# EasyEDA Pro project ProDoc_XC7K35T_GTP_USB_Core_LiteRevB.1.brd_2025-10-08.epro, board XC7K35T_GTP_USB_Core_LiteRevB.1.pcb
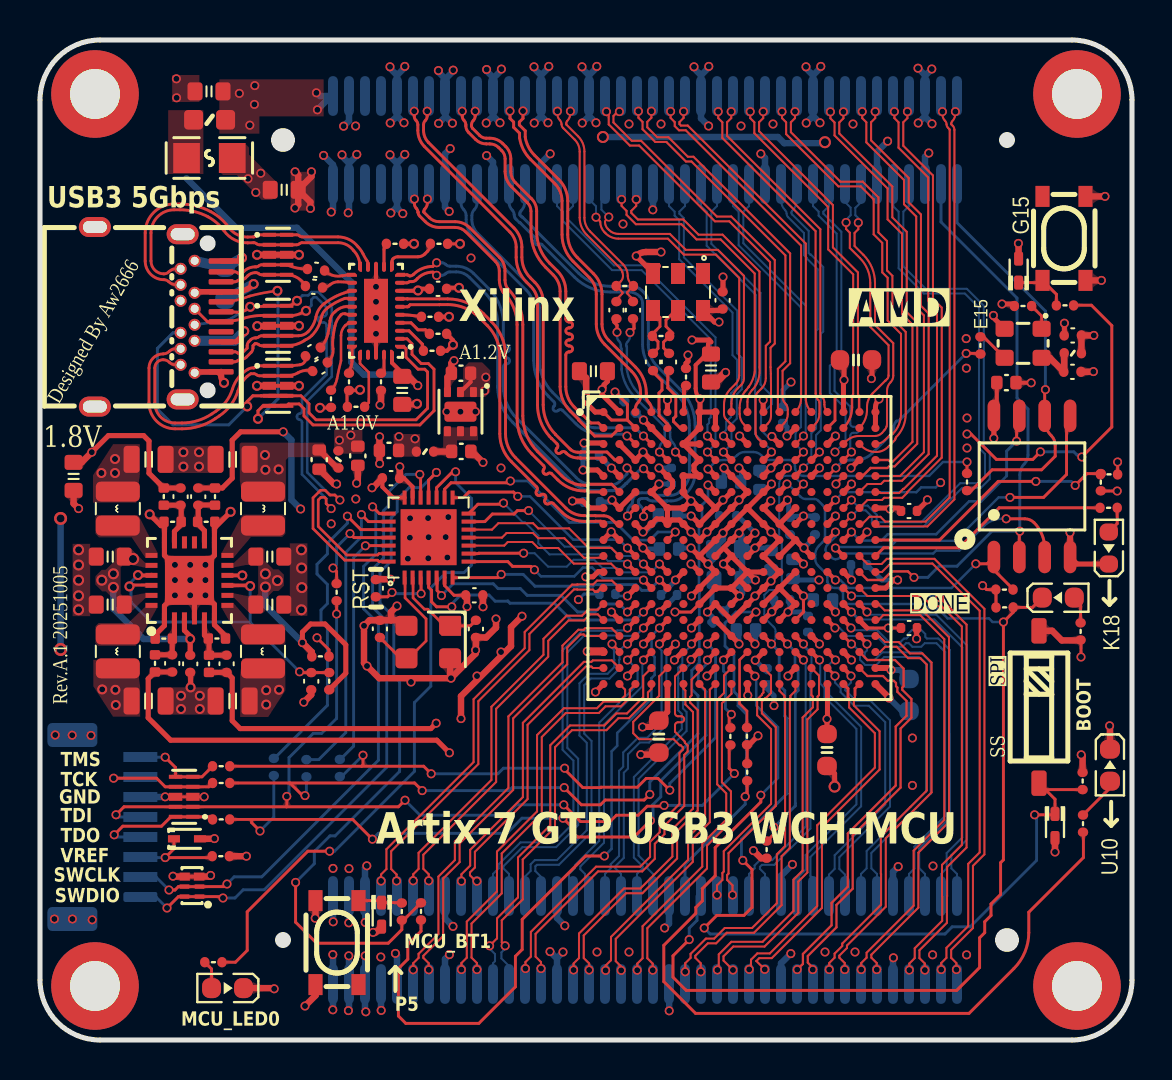
[diagram p15: board, top side]
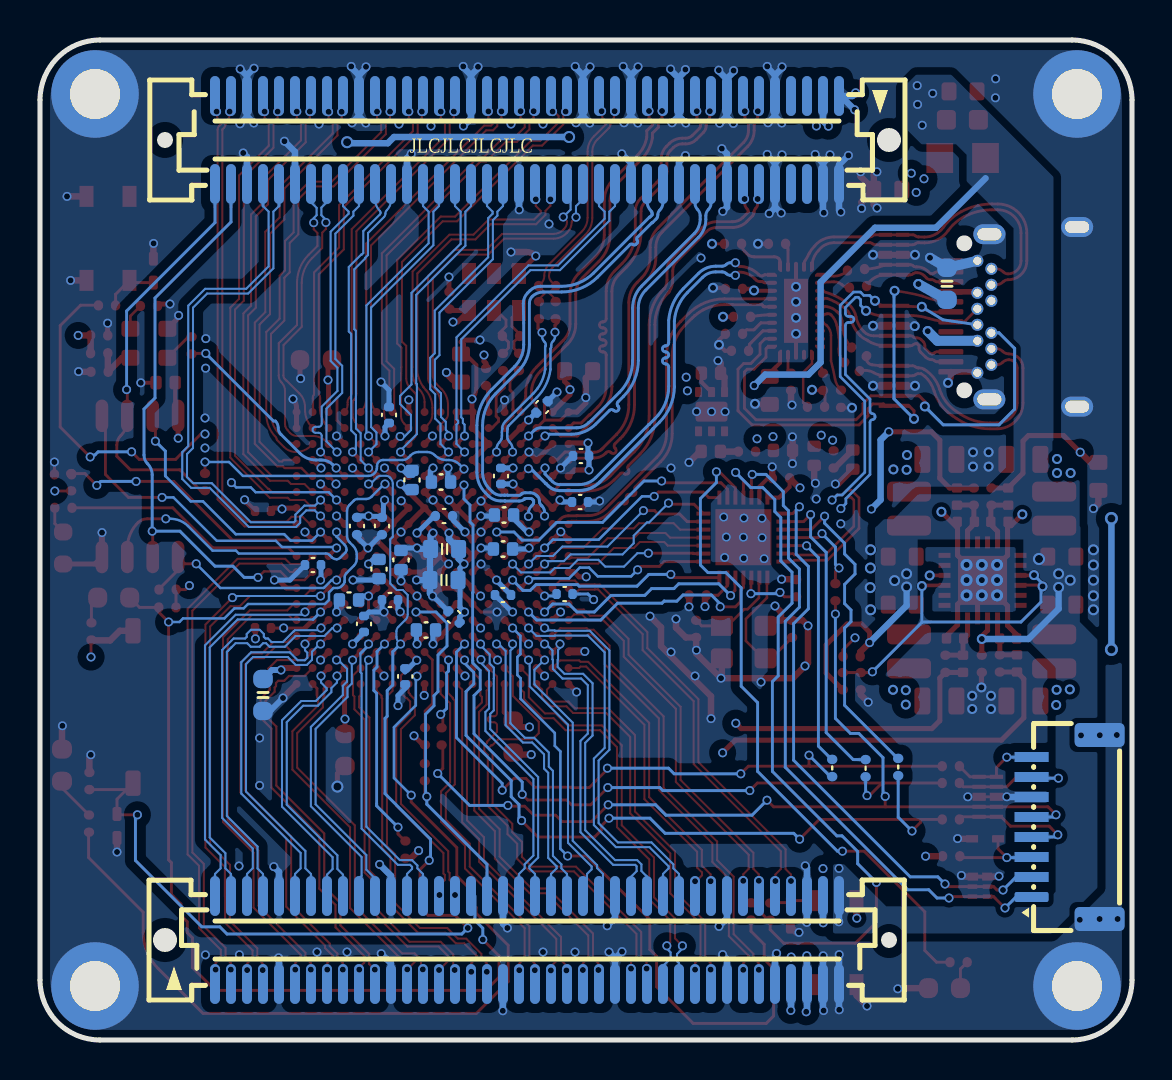
[diagram p16: board, bottom side, seen from below]

Outline 54.6 x 50 mm; copper layers: Top Layer, 内GND, 内GND&PWR, Bottom Layer. Coordinates in mm from the lower left corner of the outline.
Outline path: 0,47 0,3 arc(0.88,0.88) 3,0 51.6,0 arc(53.72,0.88) 54.6,3 54.6,47 arc(53.72,49.12) 51.6,50 3,50 arc(0.88,49.12) 0,47
Stack: Top Layer 0.035mm 外层铜厚1oz / Dielectric1 0.2104mm 7628 RC49% 8.6mil / 内GND 0.0152mm 内层铜厚 / Dielectric2 1.065mm 1.1mm H/HOZ Copper / 内GND&PWR 0.0152mm 内层铜厚 / Dielectric3 0.2104mm 7628 RC49% 8.6mil / Bottom Layer 0.035mm 外层铜厚1oz

## Design rules (mm)
net USBC_RX_P: DP6
net USBC_RX_N: DP6
net MGT_TX3_N: DP9
net MGT_TX2_N: DP7
net MGT_TX1_N: DP11
net MGT_TX0_N: DP16
net MGT_TX3_P: DP9
net MGT_TX2_P: DP7
net MGT_TX1_P: DP11
net MGT_TX0_P: DP16
net MGT_RX1_N: DP12
net MGT_RX2_N: DP8
net MGT_RX0_N: DP10
net MGT_RX3_N: DP20
net MGT_RX1_P: DP12
net MGT_RX2_P: DP8
net MGT_RX0_P: DP10
net MGT_RX3_P: DP20
net MGT_CLK1_N: DP13
net MGT_CLK0_N: DP14
net MGT_CLK1_P: DP13
net MGT_CLK0_P: DP14
net CLK_125M_P: DP23
net CLK_125M_N: DP23
net USB3_RX_N: DP17
net USB3_RX_P: DP17
net IO_L1N_T0_AD0N_15: DP25
net IO_L1P_T0_AD0P_15: DP25
net IO_L3N_T0_DQS_AD1N_15: DP26
net IO_L3P_T0_DQS_AD1P_15: DP26
net IO_L2N_T0_AD8N_15: DP24
net IO_L2P_T0_AD8P_15: DP24
net IO_L5N_T0_AD9N_15: DP27
net IO_L5P_T0_AD9P_15: DP27
net IO_L4N_T0_15: DP28
net IO_L4P_T0_15: DP28
net IO_L6P_T0_15: DP31
net IO_L7N_T1_AD2N_15: DP29
net IO_L7P_T1_AD2P_15: DP29
net IO_L6N_T0_VREF_15: DP31
net IO_L8P_T1_AD10P_15: DP30
net IO_L11N_T1_SRCC_15: DP32
net IO_L11P_T1_SRCC_15: DP32
net IO_L12P_T1_MRCC_15: DP39
net IO_L8N_T1_AD10N_15: DP30
net IO_L10P_T1_AD11P_15: DP33
net IO_L12N_T1_MRCC_15: DP39
net IO_L10N_T1_AD11N_15: DP33
net IO_L15P_T2_DQS_15: DP36
net IO_L16P_T2_A28_15: DP34
net IO_L14N_T2_SRCC_15: DP40
net IO_L14P_T2_SRCC_15: DP40
net IO_L20N_T3_A19_15: DP48
net IO_L20P_T3_A20_15: DP48
net IO_L15N_T2_DQS_ADV_B_15: DP36
net IO_L16N_T2_A27_15: DP34
net IO_L18P_T2_A24_15: DP37
net IO_L17P_T2_A26_15: DP38
net IO_L24P_T3_RS1_15: DP41
net IO_L19P_T3_A22_15: DP47
net IO_L23P_T3_FOE_B_15: DP35
net IO_L18N_T2_A23_15: DP37
net IO_L17N_T2_A25_15: DP38
net IO_L24N_T3_RS0_15: DP41
net IO_L19N_T3_A21_VREF_15: DP47
net IO_L23N_T3_FWE_B_15: DP35
net IO_L13N_T2_MRCC_34: DP46
net IO_L3N_T0_DQS_34: DP67
net IO_L7N_T1_34: DP69
net IO_L9P_T1_DQS_34: DP42
net IO_L9N_T1_DQS_34: DP42
net IO_L15N_T2_DQS_34: DP66
net IO_L3P_T0_DQS_34: DP67
net IO_L7P_T1_34: DP69
net IO_L13P_T2_MRCC_34: DP46
net IO_L14N_T2_SRCC_34: DP62
net IO_L15P_T2_DQS_34: DP66
net IO_L16N_T2_34: DP73
net IO_L12N_T1_MRCC_34: DP63
net IO_L14P_T2_SRCC_34: DP62
net IO_L17N_T2_34: DP49
net IO_L16P_T2_34: DP73
net IO_L12P_T1_MRCC_34: DP63
net IO_L17P_T2_34: DP49
net IO_L18P_T2_34: DP74
net IO_L18N_T2_34: DP74
net IO_L21P_T3_DQS_34: DP64
net IO_L21N_T3_DQS_34: DP64
net IO_L20N_T3_34: DP75
net IO_L20P_T3_34: DP75
net IO_L23N_T3_34: DP58
net IO_L22P_T3_34: DP65
net IO_L22N_T3_34: DP65
net IO_L23P_T3_34: DP58
net IO_L24N_T3_34: DP50
net IO_L24P_T3_34: DP50
net IO_L24P_T3_A01_D17_14: DP43
net IO_L24N_T3_A00_D16_14: DP43
net IO_L23P_T3_A03_D19_14: DP44
net IO_L23N_T3_A02_D18_14: DP44
net IO_L21P_T3_DQS_14: DP45
net IO_L19P_T3_A10_D26_14: DP61
net IO_L19N_T3_A09_D25_VREF_14: DP61
net IO_L21N_T3_DQS_A06_D22_14: DP45
net IO_L13P_T2_MRCC_14: DP60
net IO_L20P_T3_A08_D24_14: DP57
net IO_L20N_T3_A07_D23_14: DP57
net IO_L11P_T1_SRCC_14: DP72
net IO_L13N_T2_MRCC_14: DP60
net IO_L17P_T2_A14_D30_14: DP59
net IO_L7P_T1_D09_14: DP70
net IO_L9P_T1_DQS_14: DP55
net IO_L11N_T1_SRCC_14: DP72
net IO_L14P_T2_SRCC_14: DP54
net IO_L17N_T2_A13_D29_14: DP59
net IO_L18P_T2_A12_D28_14: DP56
net IO_L4P_T0_D04_14: DP68
net IO_L7N_T1_D10_14: DP70
net IO_L9N_T1_DQS_D13_14: DP55
net IO_L14N_T2_SRCC_14: DP54
net IO_L16P_T2_CSI_B_14: DP53
net IO_L16N_T2_A15_D31_14: DP53
net IO_L18N_T2_A11_D27_14: DP56
net IO_L4N_T0_D05_14: DP68
net IO_L10P_T1_D14_14: DP51
net IO_L10N_T1_D15_14: DP51
net IO_L15P_T2_DQS_RDWR_B_14: DP52
net IO_L15N_T2_DQS_DOUT_CSO_B_14: DP52
net CH32_USB2_D_N: DP76
net CH32_USB2_D_P: DP76
net MGT_EXTCLK0_P: DP71
net MGT_EXTCLK0_N: DP71
template: 通用免费4层工艺
spacing copperThickness1oz (default): track to track 0.1, other pairs 0.1 to 0.3
spacing copperThickness2oz: track to track 0.203, other pairs 0.152 to 0.3
track width copperThickness2oz: min 0.203, default 0.254, max 2.54
track width trackW_1oz_50R_3313 (default): min 0.1, default 0.145, max 10
track width trackW_1oz_40R_3313: min 0.127, default 0.2, max 2.54
track width trackWidth1oz_POWER: min 0.1, default 0.32, max 3
track width trackWidthAnalog: min 0.1, default 0.2, max 10
differential pair diff_100R_3313 (default): width min 0.1, default 0.102, max 2; gap min 0.132, default 0.135
differential pair diff_100R_7628: width min 0.1, default 0.14, max 2.54; gap min 0.102, default 0.12
differential pair diff_80R_3313: width min 0.1, default 0.15, max 2.54; gap min 0.1, default 0.102
differential pair diff_85R_3313: width min 0.127, default 0.15, max 2.54; gap min 0.102, default 0.13
differential pair diff_90R_3313: width min 0.102, default 0.13, max 2; gap min 0.102, default 0.13
differential pair diff_90R_7628: width min 0.1, default 0.195, max 2.54; gap min 0.102, default 0.12
differential pair diff_90R_85R_3313: width min 0.127, default 0.145, max 2.54; gap min 0.102, default 0.14
differential pair diff_90R_Mini_3313: width min 0.102, default 0.115, max 2.54; gap min 0.102, default 0.152
differential pair diff_100R_3313_max: width min 0.1, default 0.12, max 2.54; gap min 0.1, default 0.145
via viaSize (default): diameter min 0.4, default 0.45, max 10; hole min 0.3, default 0.3, max 6.3
via viaSizePOWER: diameter min 0.5, default 0.5, max 10; hole min 0.3, default 0.35, max 6.3
net GND uses trackWidth1oz_POWER
net MGT_TX3_N uses diff_90R_85R_3313
net MGT_TX2_N uses diff_90R_85R_3313
net MGT_TX1_N uses diff_90R_85R_3313
net MGT_TX0_N uses diff_90R_85R_3313
net MGT_TX3_P uses diff_90R_85R_3313
net MGT_TX2_P uses diff_90R_85R_3313
net MGT_TX1_P uses diff_90R_85R_3313
net MGT_TX0_P uses diff_90R_85R_3313
net MGT_RX1_N uses diff_90R_85R_3313
net MGT_RX2_N uses diff_90R_85R_3313
net MGT_RX0_N uses diff_90R_85R_3313
net MGT_RX3_N uses diff_90R_85R_3313
net MGT_RX1_P uses diff_90R_85R_3313
net MGTAVCC_1V0 uses trackWidth1oz_POWER
net MGT_RX2_P uses diff_90R_85R_3313
net MGT_RX0_P uses diff_90R_85R_3313
net MGT_RX3_P uses diff_90R_85R_3313
net MGT_CLK1_N uses diff_100R_3313_max
net MGT_CLK0_N uses diff_100R_3313_max
net MGT_CLK1_P uses diff_100R_3313_max
net MGT_CLK0_P uses diff_100R_3313_max
net VCC_1V0 uses trackWidth1oz_POWER
net VCC_1V8 uses trackWidth1oz_POWER
net VCC_5V uses trackWidth1oz_POWER
net VCC_2V5 uses trackWidth1oz_POWER
net VCC_1V8_F uses trackWidth1oz_POWER
net VCC_3V3_CLK uses trackWidth1oz_POWER
net VCC_2V5_CLK uses trackWidth1oz_POWER
net VCC_3V3 uses trackWidth1oz_POWER
net CH32_USB2_D_N uses diff_90R_3313
net CH32_USB2_D_P uses diff_90R_3313
diff pair DP9 uses diff_90R_85R_3313
diff pair DP7 uses diff_90R_85R_3313
diff pair DP11 uses diff_90R_85R_3313
diff pair DP16 uses diff_90R_85R_3313
diff pair DP12 uses diff_90R_85R_3313
diff pair DP8 uses diff_90R_85R_3313
diff pair DP10 uses diff_90R_85R_3313
diff pair DP20 uses diff_90R_85R_3313
diff pair DP13 uses diff_100R_3313_max
diff pair DP14 uses diff_100R_3313_max
diff pair DP76 uses diff_90R_3313
pour e396 uses copperRegion1
pour e11925 uses copperRegion2
pour e8768 uses copperRegion2

## Placement (name value [footprint] x y rotation side)
C1  4.7uF  [C0603_1608M]  9.25 37.81 270 bottom
C2  4.7uF  [C0603_1608M_S]  33.55 33.6 270 top
C3  4.7uF  [C0603_1608M_S]  27.67 33.44 0 top
C4  470nF  [C0402_1005M_BGA]  31.55 28.2 90 bottom
C5  470nF  [C0402_1005M_BGA]  29.5 31.65 315 bottom
C6  470nF  [C0402_1005M_BGA]  27.6 26.9 0 bottom
C7  470nF  [C0402_1005M_BGA]  27.55 29.2 180 bottom
C8  100nF  [C0402_1005M_S]  14 33.66 30 top
C9  100nF  [C0402_1005M_S]  13.65 34.41 30 top
C10  100nF  [C0402_1005M_S]  13.8 38.51 355 top
C11  100nF  [C0402_1005M_S]  13.7 37.66 355 top
C12  100nF  [C0402_1005M_S]  31.45 33.9 270 top
C13  100nF  [C0402_1005M_S]  30.65 33.9 270 top
C14  100nF  [C0402_1005M_S]  29.65 36.49 270 top
C15  100nF  [C0402_1005M_S]  28.82 36.49 270 top
C16  220pF  [C0402_1005M_S]  7.03 27.17 90 top
C17  22uF  [C0805_2012M_S]  5.43 29.03 180 top
C18  22uF  [C0603_1608M_S]  3.51 21.77 0 top
C19  22uF  [C0603_1608M_S]  11.49 24.17 180 top
C20  22uF  [C0603_1608M_S]  3.51 24.17 0 top
C21  22uF  [C0603_1608M_S]  11.49 21.77 180 top
C22  2.2uF  [C0402_1005M_S]  7.51 18.81 90 top
C23  2.2uF  [C0402_1005M_S]  34.4 26.2 0 bottom
C24  2.2uF  [C0402_1005M_S]  37.5 25.7 90 bottom
C25  2.2uF  [C0402_1005M]  34.55 27.9 0 bottom
C26  2.2uF  [C0402_1005M]  35.3 20.5 0 bottom
C27  220pF  [C0402_1005M_S]  6.61 18.83 270 top
C28  22uF  [C0805_2012M_S]  5.43 16.95 0 top
C29  220pF  [C0402_1005M_S]  9.33 18.81 270 top
C30  22uF  [C0805_2012M_S]  9.63 16.95 180 top
C31  220pF  [C0402_1005M_S]  7.91 27.17 90 top
C32  22uF  [C0805_2012M_S]  9.63 29.03 180 top
C158  10uF  [C0402_1005M_S]  51.64 35.23 0 top
C159  10uF  [C0402_1005M_S]  51.62 33.41 180 top
C160  2.2uF  [C0402_1005M]  48.32 32.87 180 top
C161  470nF  [C0402_1005M_BGA]  40.95 23.75 180 bottom
C162  470nF  [C0402_1005M_BGA]  43.45 20.6 180 top
C163  470nF  [C0402_1005M_BGA]  38.4 20.8 270 bottom
C164  470nF  [C0402_1005M_BGA]  36.34 18.18 90 bottom
C165  4.7uF  [C0603_1608M]  39.35 14.5 90 top
C166  4.7uF  [C0603_1608M]  43.45 17.25 90 bottom
C170  10nF  [C0402_1005M_S]  13.56 17.94 90 top
C171  2.2uF  [C0402_1005M]  17.45 29.48 0 top
C173  2.2uF  [C0402_1005M]  13.96 29.02 90 top
C174  2.2uF  [C0402_1005M]  21.06 29.43 180 top
C175  2.2uF  [C0402_1005M]  15.89 29.21 90 top
C176  2.2uF  [C0402_1005M]  21.05 33.34 0 top
C177  470nF  [C0402_1005M_BGA]  37.15 31.25 270 bottom
C178  470nF  [C0402_1005M_BGA]  43.45 26.45 180 top
C179  4.7uF  [C0603_1608M]  40.8 34 180 top
C180  470nF  [C0402_1005M_BGA]  28.37 22.3 0 bottom
C181  470nF  [C0402_1005M_BGA]  31.45 22.25 180 bottom
C182  4.7uF  [C0603_1608M]  30.94 15.17 90 top
C185  4.7uF  [C0603_1608M_S]  34.4 23 180 bottom
C186  2.2uF  [C0402_1005M]  31.45 24.55 0 bottom
C187  2.2uF  [C0402_1005M]  36.55 24 270 bottom
C188  2.2uF  [C0402_1005M]  36 28 270 bottom
C189  2.2uF  [C0402_1005M]  31.4 26.25 0 bottom
C190  10uF  [C0402_1005M_S]  34.13 36.98 270 top
C191  100nF  [C0402_1005M_S]  19.9 37.56 180 top
C192  4.7uF  [C0603_1608M_S]  18.11 32.48 90 top
C193  2.2uF  [C0402_1005M_BGA]  37.1 22 180 bottom
C194  2.2uF  [C0402_1005M]  37.65 23.55 90 bottom
C195  2.2uF  [C0402_1005M]  39.15 22 180 bottom
C197  2.2uF  [C0402_1005M_S]  38.75 25.7 90 bottom
C198  4.7uF  [C0603_1608M_S]  1.68 28.18 90 top
C199  2.2uF  [C0402_1005M_BGA]  33.9 21.15 225 bottom
C200  4.7uF  [C0603_1608M_S]  34.37 24.55 180 bottom
C201  100nF  [C0402_1005M_S]  16.79 22.59 270 top
C202  100nF  [C0402_1005M_S]  21.71 22.24 180 top
C203  100nF  [C0402_1005M_S]  17.55 28.09 180 top
C204  10pF  [C0402_1005M_S]  16.99 20.56 270 top
C205  10pF  [C0402_1005M_S]  21.79 20.56 90 top
C206  10uF  [C0603_1608M_S]  12.21 42.51 180 top
C207  10uF  [C0603_1608M_S]  8.45 47.43 0 top
CN7  X0802FVS-80AS-LPV01  [CONN-SMD_80P-P0.80_XKB_X0802FVS-80AS-LPV01]  30.25 45 0 bottom
CN8  X0802FVS-80AS-LPV01  [CONN-SMD_80P-P0.80_XKB_X0802FVS-80AS-LPV01]  30.25 5 180 bottom
D1  RCLAMP0524P  [DFN2510-10_L2.5-W1.0-P0.50-BL]  11.9 39.26 270 top
D2  RCLAMP0524P  [DFN2510-10_L2.5-W1.0-P0.50-BL]  11.9 35.71 270 top
D3  RCLAMP0524P  [DFN2510-10_L2.5-W1.0-P0.50-BL]  11.9 32.71 270 top
D6  RCLAMP0524P  [DFN2510-10_L2.5-W1.0-P0.50-BL]  7.21 12.16 90 top
D7  ESD5Z3.3T1G-MS  [SOD-523_L1.2-W0.8-LS1.6-RD#2]  48.93 38.47 90 top
D8  ESD5Z3.3T1G-MS  [SOD-523_L1.2-W0.8-LS1.6-RD#2]  17.08 6.27 270 top
D9  ESD5Z3.3T1G-MS  [SOD-523_L1.2-W0.8-LS1.6-RD]  7.35 10.06 0 top
D10  RCLAMP0522P.TCT  [UDFN-6_L1.6-W1.0-P0.50-BL]  7.6 7.67 90 top
D11  ESD5Z3.3T1G-MS  [SOD-523_L1.2-W0.8-LS1.6-RD#2]  50.75 10.7 270 top
F1  SMD0805-050-6  [F0805]  8.47 44.1 180 top
FB4  BLM15PD121SN1D  [FB0402_1005M_S]  51.64 34.34 180 top
FB6  BLM15PD121SN1D  [FB0402_1005M_S]  19.25 29.42 0 top
FB7  BLM18PG121SN1D  [FB0603_1608M]  8.48 46.01 0 top
FB8  BLM15PD121SN1D  [FB0402_1005M_S]  14.92 29.03 90 top
H1  -  [M2.5螺丝安装孔_金属化_带过孔]  2.75 2.7 0 top
H2  -  [M2.5螺丝安装孔_金属化_带过孔]  51.85 47.3 0 top
H3  -  [M2.5螺丝安装孔_金属化_带过孔]  2.75 47.3 0 top
H4  -  [M2.5螺丝安装孔_金属化_带过孔]  51.85 2.7 0 top
L3  2.2uH  [IND-SMD_L2.5-W2.0-L2520M]  3.89 19.43 90 top
L4  2.2uH  [IND-SMD_L2.5-W2.0-L2520M]  3.89 26.57 90 top
L5  2.2uH  [IND-SMD_L2.5-W2.0-L2520M]  11.15 19.43 90 top
L6  2.2uH  [IND-SMD_L2.5-W2.0-L2520M]  11.15 26.57 270 top
LED2  NCD0603G1  [LED0603_1608M]  50.91 22.12 180 top
LED4  NCD0603G1  [LED0603_1608M]  53.5 13.74 90 top
LED5  NCD0603G1  [LED0603_1608M_S]  53.44 24.6 270 top
LED6  NCD0603G1  [LED0603_1608M]  9.38 2.59 0 top
OSC1  125MHz  [OSC-SMD_6P-L3.2-W2.5-BL-1]  31.9 37.4 180 top
OSC3  50MHz  [OSC-SMD_4P-L2.5-W2.0-BL-1]  49.16 34.83 180 top
R1  100Ω  [R0402_1005M_S]  32.3 33.15 90 top
R2  910kΩ  [R0402_1005M_S]  19.5 36.16 180 top
R3  100kΩ  [R0402_1005M_S]  6.63 25.91 0 top
R4  100kΩ  [R0402_1005M_S]  6.19 20.07 180 top
R10  453kΩ  [R0402_1005M_S]  6.19 27.17 90 top
R11  200kΩ  [R0402_1005M_S]  5.75 18.83 90 top
R12  22Ω  [R0402_1005M_S]  9.06 11.03 180 top
R15  22Ω  [R0402_1005M_S]  9.06 12.85 180 top
R16  150kΩ  [R0402_1005M_S]  8.45 18.81 90 top
R17  100kΩ  [R0402_1005M_S]  8.85 20.07 0 top
R18  68kΩ  [R0402_1005M_S]  8.75 27.17 270 top
R19  100kΩ  [R0402_1005M_S]  8.31 25.91 0 top
R21  22Ω  [R0402_1005M_S]  9.06 13.69 180 top
R22  510Ω  [R0402_1005M_S]  53.04 27.89 270 top
R23  510Ω_NC  [R0402_1005M_S]  53.45 28.28 180 top
R25  22Ω  [R0402_1005M_S]  34.52 15.18 270 top
R26  1kΩ  [R0402_1005M_S]  52.03 20.43 270 top
R29  4.7kΩ  [R0402_1005M_S]  35.36 13.39 90 top
R30  4.7kΩ  [R0402_1005M_S]  35.35 15.19 270 top
R47  4.7kΩ_NC  [R0402_1005M_S]  48.23 21.63 180 top
R89  51Ω  [R0402_1005M_S]  18.09 6.42 270 top
R91  22Ω  [R0402_1005M_S]  47.02 34.73 270 top
R92  22Ω_NC  [R0402_1005M_S]  49.15 36.7 0 top
R96  51Ω  [R0402_1005M_S]  51.25 36.73 0 top
R97  4.7kΩ  [R0402_1005M_S]  52.15 10.82 90 top
R110  22Ω  [R0402_1005M_S]  46.35 27.9 270 top
R111  18kΩ  [R0402_1005M_S]  14.02 19.18 0 top
R112  18kΩ  [R0402_1005M_S]  14.46 17.94 90 top
R113  18kΩ  [R0402_1005M_S]  48.22 22.52 180 top
R115  1kΩ  [R0402_1005M_S]  52.13 12.95 90 top
R116  1kΩ  [R0402_1005M_S]  36.33 9.52 270 top
R123  10kΩ  [R0402_1005M_S]  19.6 34.46 180 top
R124  4.7kΩ  [R0402_1005M_S]  19.9 35.31 180 top
R125  200kΩ  [R0402_1005M_S]  19.95 39.81 0 top
R126  10kΩ  [R0402_1005M_S]  17.75 39.81 180 top
R127  10kΩ  [R0402_1005M_S]  14.55 32.06 90 top
R128  10kΩ  [R0402_1005M_S]  17.05 32.91 90 top
R129  200kΩ  [R0402_1005M_S]  15.8 31.66 180 top
R130  200kΩ  [R0402_1005M_S]  15.45 32.91 270 top
R131  4.7kΩ  [R0402_1005M_S]  53.43 26.61 0 top
R132  100Ω  [R0402_1005M_S]  31.05 35.2 180 top
R133  100Ω  [R0402_1005M_S]  29.24 37.7 180 top
R134  22Ω  [R0402_1005M_S]  9.04 9.19 180 top
R135  22Ω  [R0402_1005M_S]  14.99 13.6 270 bottom
R136  22Ω  [R0402_1005M_S]  14.83 22.39 270 top
R137  22Ω  [R0402_1005M_S]  13.32 13.59 270 bottom
R138  22Ω  [R0402_1005M_S]  11.69 13.65 270 bottom
R139  4.7kΩ  [R0402_1005M_S]  8.67 3.89 180 top
R140  51Ω  [R0402_1005M_S]  19.05 6.43 270 top
SW6  SKRPACE010  [KEY-SMD_4P-L4.2-W3.2-P2.20-LS4.6]  51.2 40.08 90 top
SW7  SKRPACE010  [KEY-SMD_4P-L4.2-W3.2-P2.20-LS4.6]  14.85 4.87 270 top
SW8  DSHP01TSGET  [SW-SMD_DSHP01TSGET]  49.95 16.65 180 top
U1  XC7A35T-2CSG325C  [BGA324-CSG325_L15.0-W15.0-R18-C18-P0.80-BL]  34.97 24.6 270 top
U2  EA3059  [VQFN-24_L4.0-W4.0-P0.50-TL-EP2.5]  7.47 22.98 90 top
U3  HD3SS3220RNHR  [WQFN-30_L4.5-W2.5-P0.4-BL-EP]  16.8 36.46 90 top
U4  TLV73312PQDRVRQ1  [WSON-6_L2.0-W2.0-P0.65-TL-EP]  21.02 31.42 270 top
U5  CH32V305GBU6  [QFN-28_L4.0-W4.0-P0.40-BL-EP2.8]  19.43 25.12 0 top
U15  W25Q128JVSIQ  [SOIC-8_L5.3-W5.3-P1.27-LS8.0-BL]  49.6 27.68 0 top
U16  ZX-SH1.0-8PWT  [CONN-SMD_8P-P1.00_MEGASTAR_ZX-SH1.0-8PWT]  3.32 10.65 90 bottom
USB1  HX TYPE-C 24P QCHT  [TYPE-C-SMD_TYPE-C-24P_QCHT]  5.9 36.16 270 top
X2  12MHz  [CRYSTAL-SMD_4P-L3.2-W2.5-BL_Small]  19.41 19.9 180 top

## Footprints (pads in the part's own frame, mm; a bottom-side part is the same pattern mirrored in y, then rotated)
BGA324-CSG325_L15.0-W15.0-R18-C18-P0.80-BL
  round 0.4 smd: A1(-6.8,-6.8) A2(-6.8,-6) A3(-6.8,-5.2) A4(-6.8,-4.4) A5(-6.8,-3.6) A6(-6.8,-2.8) A7(-6.8,-2) A8(-6.8,-1.2) A9(-6.8,-0.4) A10(-6.8,0.4) A11(-6.8,1.2) A12(-6.8,2) A13(-6.8,2.8) A14(-6.8,3.6) A15(-6.8,4.4) A16(-6.8,5.2) A17(-6.8,6) A18(-6.8,6.8) B1(-6,-6.8) B2(-6,-6) B3(-6,-5.2) B4(-6,-4.4) B5(-6,-3.6) B6(-6,-2.8) B7(-6,-2) B8(-6,-1.2) B9(-6,-0.4) B10(-6,0.4) B11(-6,1.2) B12(-6,2) B13(-6,2.8) B14(-6,3.6) B15(-6,4.4) B16(-6,5.2) B17(-6,6) B18(-6,6.8) C1(-5.2,-6.8) C2(-5.2,-6) C3(-5.2,-5.2) C4(-5.2,-4.4) C5(-5.2,-3.6) C6(-5.2,-2.8) C7(-5.2,-2) C8(-5.2,-1.2) C9(-5.2,-0.4) C10(-5.2,0.4) C11(-5.2,1.2) C12(-5.2,2) C13(-5.2,2.8) C14(-5.2,3.6) C15(-5.2,4.4) C16(-5.2,5.2) C17(-5.2,6) C18(-5.2,6.8) D1(-4.4,-6.8) D2(-4.4,-6) D3(-4.4,-5.2) D4(-4.4,-4.4) D5(-4.4,-3.6) D6(-4.4,-2.8) D7(-4.4,-2) D8(-4.4,-1.2) D9(-4.4,-0.4) D10(-4.4,0.4) D11(-4.4,1.2) D12(-4.4,2) D13(-4.4,2.8) D14(-4.4,3.6) D15(-4.4,4.4) D16(-4.4,5.2) D17(-4.4,6) D18(-4.4,6.8) E1(-3.6,-6.8) E2(-3.6,-6) E3(-3.6,-5.2) E4(-3.6,-4.4) E5(-3.6,-3.6) E6(-3.6,-2.8) E7(-3.6,-2) E8(-3.6,-1.2) E9(-3.6,-0.4) E10(-3.6,0.4) E11(-3.6,1.2) E12(-3.6,2) E13(-3.6,2.8) E14(-3.6,3.6) E15(-3.6,4.4) E16(-3.6,5.2) E17(-3.6,6) E18(-3.6,6.8) F1(-2.8,-6.8) F2(-2.8,-6) F3(-2.8,-5.2) F4(-2.8,-4.4) F5(-2.8,-3.6) F6(-2.8,-2.8) F7(-2.8,-2) F8(-2.8,-1.2) F9(-2.8,-0.4) F10(-2.8,0.4) F11(-2.8,1.2) F12(-2.8,2) F13(-2.8,2.8) F14(-2.8,3.6) F15(-2.8,4.4) F16(-2.8,5.2) F17(-2.8,6) F18(-2.8,6.8) G1(-2,-6.8) G2(-2,-6) G3(-2,-5.2) G4(-2,-4.4) G5(-2,-3.6) G6(-2,-2.8) G7(-2,-2) G8(-2,-1.2) G9(-2,-0.4) G10(-2,0.4) G11(-2,1.2) G12(-2,2) G13(-2,2.8) G14(-2,3.6) G15(-2,4.4) G16(-2,5.2) G17(-2,6) G18(-2,6.8) H1(-1.2,-6.8) H2(-1.2,-6) H3(-1.2,-5.2) H4(-1.2,-4.4) H5(-1.2,-3.6) H6(-1.2,-2.8) H7(-1.2,-2) H8(-1.2,-1.2) H9(-1.2,-0.4) H10(-1.2,0.4) H11(-1.2,1.2) H12(-1.2,2) H13(-1.2,2.8) H14(-1.2,3.6) H15(-1.2,4.4) H16(-1.2,5.2) H17(-1.2,6) H18(-1.2,6.8) J1(-0.4,-6.8) J2(-0.4,-6) J3(-0.4,-5.2) J4(-0.4,-4.4) J5(-0.4,-3.6) J6(-0.4,-2.8) J7(-0.4,-2) J8(-0.4,-1.2) J9(-0.4,-0.4) J10(-0.4,0.4) J11(-0.4,1.2) J12(-0.4,2) J13(-0.4,2.8) J14(-0.4,3.6) J15(-0.4,4.4) J16(-0.4,5.2) J17(-0.4,6) J18(-0.4,6.8) K1(0.4,-6.8) K2(0.4,-6) K3(0.4,-5.2) K4(0.4,-4.4) K5(0.4,-3.6) K6(0.4,-2.8) K7(0.4,-2) K8(0.4,-1.2) K9(0.4,-0.4) K10(0.4,0.4) K11(0.4,1.2) K12(0.4,2) K13(0.4,2.8) K14(0.4,3.6) K15(0.4,4.4) K16(0.4,5.2) K17(0.4,6) K18(0.4,6.8) L1(1.2,-6.8) L2(1.2,-6) L3(1.2,-5.2) L4(1.2,-4.4) L5(1.2,-3.6) L6(1.2,-2.8) L7(1.2,-2) L8(1.2,-1.2) L9(1.2,-0.4) L10(1.2,0.4) L11(1.2,1.2) L12(1.2,2) L13(1.2,2.8) L14(1.2,3.6) L15(1.2,4.4) L16(1.2,5.2) L17(1.2,6) L18(1.2,6.8) M1(2,-6.8) M2(2,-6) M3(2,-5.2) M4(2,-4.4) M5(2,-3.6) M6(2,-2.8) M7(2,-2) M8(2,-1.2) M9(2,-0.4) M10(2,0.4) M11(2,1.2) M12(2,2) M13(2,2.8) M14(2,3.6) M15(2,4.4) M16(2,5.2) M17(2,6) M18(2,6.8) N1(2.8,-6.8) N2(2.8,-6) N3(2.8,-5.2) N4(2.8,-4.4) N5(2.8,-3.6) N6(2.8,-2.8) N7(2.8,-2) N8(2.8,-1.2) N9(2.8,-0.4) N10(2.8,0.4) N11(2.8,1.2) N12(2.8,2) N13(2.8,2.8) N14(2.8,3.6) N15(2.8,4.4) N16(2.8,5.2) N17(2.8,6) N18(2.8,6.8) P1(3.6,-6.8) P2(3.6,-6) P3(3.6,-5.2) P4(3.6,-4.4) P5(3.6,-3.6) P6(3.6,-2.8) P7(3.6,-2) P8(3.6,-1.2) P9(3.6,-0.4) P10(3.6,0.4) P11(3.6,1.2) P12(3.6,2) P13(3.6,2.8) P14(3.6,3.6) P15(3.6,4.4) P16(3.6,5.2) P17(3.6,6) P18(3.6,6.8) R1(4.4,-6.8) R2(4.4,-6) R3(4.4,-5.2) R4(4.4,-4.4) R5(4.4,-3.6) R6(4.4,-2.8) R7(4.4,-2) R8(4.4,-1.2) R9(4.4,-0.4) R10(4.4,0.4) R11(4.4,1.2) R12(4.4,2) R13(4.4,2.8) R14(4.4,3.6) R15(4.4,4.4) R16(4.4,5.2) R17(4.4,6) R18(4.4,6.8) T1(5.2,-6.8) T2(5.2,-6) T3(5.2,-5.2) T4(5.2,-4.4) T5(5.2,-3.6) T6(5.2,-2.8) T7(5.2,-2) T8(5.2,-1.2) T9(5.2,-0.4) T10(5.2,0.4) T11(5.2,1.2) T12(5.2,2) T13(5.2,2.8) T14(5.2,3.6) T15(5.2,4.4) T16(5.2,5.2) T17(5.2,6) T18(5.2,6.8) U1(6,-6.8) U2(6,-6) U3(6,-5.2) U4(6,-4.4) U5(6,-3.6) U6(6,-2.8) U7(6,-2) U8(6,-1.2) U9(6,-0.4) U10(6,0.4) U11(6,1.2) U12(6,2) U13(6,2.8) U14(6,3.6) U15(6,4.4) U16(6,5.2) U17(6,6) U18(6,6.8) V1(6.8,-6.8) V2(6.8,-6) V3(6.8,-5.2) V4(6.8,-4.4) V5(6.8,-3.6) V6(6.8,-2.8) V7(6.8,-2) V8(6.8,-1.2) V9(6.8,-0.4) V10(6.8,0.4) V11(6.8,1.2) V12(6.8,2) V13(6.8,2.8) V14(6.8,3.6) V15(6.8,4.4) V16(6.8,5.2) V17(6.8,6) V18(6.8,6.8)
C0402_1005M
  rrect 0.57x0.68 smd: 1(-0.48,0) 2(0.48,0)
C0402_1005M_BGA
  custom 0.424x0.5 smd: 1(-0.4,0) 2(0.4,0)
C0402_1005M_S
  rrect 0.47x0.52 smd: 1(-0.43,0) 2(0.43,0)
C0603_1608M
  rrect 0.92x0.98 smd: 1(-0.8,0) 2(0.8,0)
C0603_1608M_S
  rrect 0.75x0.9 smd: 1(-0.7,0) 2(0.7,0)
C0805_2012M_S
  rrect 0.8x1.35 smd: 1(-0.85,0) 2(0.85,0)
CONN-SMD_8P-P1.00_MEGASTAR_ZX-SH1.0-8PWT
  rrect 0.5x1.7 smd: 1(-3.5,1.7)
  rect 0.5x1.7 smd: 2(-2.5,1.7) 3(-1.5,1.7) 4(-0.5,1.7) 5(0.5,1.7) 6(1.5,1.7) 7(2.5,1.7) 8(3.5,1.7)
  rrect 1.2x2.5 smd: 9(4.6,-1.7) 10(-4.6,-1.7)
CONN-SMD_80P-P0.80_XKB_X0802FVS-80AS-LPV01
  rrect 0.5x2 smd: 1(-15.6,-2.2) 2(-15.6,2.2) 3(-14.8,-2.2) 4(-14.8,2.2) 5(-14,-2.2) 6(-14,2.2) 7(-13.2,-2.2) 8(-13.2,2.2) 9(-12.4,-2.2) 10(-12.4,2.2) 11(-11.6,-2.2) 12(-11.6,2.2) 13(-10.8,-2.2) 14(-10.8,2.2) 15(-10,-2.2) 16(-10,2.2) 17(-9.2,-2.2) 18(-9.2,2.2) 19(-8.4,-2.2) 20(-8.4,2.2) 21(-7.6,-2.2) 22(-7.6,2.2) 23(-6.8,-2.2) 24(-6.8,2.2) 25(-6,-2.2) 26(-6,2.2) 27(-5.2,-2.2) 28(-5.2,2.2) 29(-4.4,-2.2) 30(-4.4,2.2) 31(-3.6,-2.2) 32(-3.6,2.2) 33(-2.8,-2.2) 34(-2.8,2.2) 35(-2,-2.2) 36(-2,2.2) 37(-1.2,-2.2) 38(-1.2,2.2) 39(-0.4,-2.2) 40(-0.4,2.2) 41(0.4,-2.2) 42(0.4,2.2) 43(1.2,-2.2) 44(1.2,2.2) 45(2,-2.2) 46(2,2.2) 47(2.8,-2.2) 48(2.8,2.2) 49(3.6,-2.2) 50(3.6,2.2) 51(4.4,-2.2) 52(4.4,2.2) 53(5.2,-2.2) 54(5.2,2.2) 55(6,-2.2) 56(6,2.2) 57(6.8,-2.2) 58(6.8,2.2) 59(7.6,-2.2) 60(7.6,2.2) 61(8.4,-2.2) 62(8.4,2.2) 63(9.2,-2.2) 64(9.2,2.2) 65(10,-2.2) 66(10,2.2) 67(10.8,-2.2) 68(10.8,2.2) 69(11.6,-2.2) 70(11.6,2.2) 71(12.4,-2.2) 72(12.4,2.2) 73(13.2,-2.2) 74(13.2,2.2) 75(14,-2.2) 76(14,2.2) 77(14.8,-2.2) 78(14.8,2.2) 79(15.6,-2.2) 80(15.6,2.2)
CRYSTAL-SMD_4P-L3.2-W2.5-BL_Small
  custom 1.1x1 smd: 1(-1.09,-0.81)
  rrect 1.1x1 smd: 2(1.092,-0.813) 3(1.092,0.813) 4(-1.092,0.813)
DFN2510-10_L2.5-W1.0-P0.50-BL
  rect 0.2x0.665 smd: 1(-1,-0.433) 2(-0.5,-0.433) 4(0.5,-0.433) 5(1,-0.433) 6(1,0.433) 7(0.5,0.433) 9(-0.5,0.433) 10(-1,0.433)
  rect 0.4x0.665 smd: 3(0,-0.433) 8(0,0.433)
F0805
  rect 1.335x1.5 smd: 1(-1.143,0) 2(1.143,0)
FB0402_1005M_S
  rrect 0.47x0.52 smd: 1(-0.43,0) 2(0.43,0)
FB0603_1608M
  rrect 0.95x0.98 smd: 1(-0.8,0) 2(0.8,0)
IND-SMD_L2.5-W2.0-L2520M
  rrect 1x2.2 smd: 1(-0.85,0) 2(0.85,0)
KEY-SMD_4P-L4.2-W3.2-P2.20-LS4.6
  rect 1.05x0.7 smd: 1(-2.1,1.075) 2(2.1,1.075) 3(-2.1,-1.075) 4(2.1,-1.075)
LED0603_1608M
  rrect 0.95x1 smd: 1(0.8,0) 2(-0.8,0)
LED0603_1608M_S
  rrect 0.85x0.92 smd: 1(0.8,0) 2(-0.8,0)
M2.5螺丝安装孔_金属化_带过孔
  round 4.38 hole 2.5: 1(0,0)
OSC-SMD_4P-L2.5-W2.0-BL-1
  rrect 0.9x0.8 smd: 1(-0.925,-0.725) 2(0.925,-0.725) 3(0.925,0.725) 4(-0.925,0.725)
OSC-SMD_6P-L3.2-W2.5-BL-1
  rect 0.7x1.05 smd: 1(-1.25,-0.925) 2(0,-0.925) 3(1.25,-0.925) 4(1.25,0.925) 5(0,0.925) 6(-1.25,0.925)
QFN-28_L4.0-W4.0-P0.40-BL-EP2.8
  rect 0.2x0.7 smd: 1(-1.2,-2) 2(-0.8,-2) 3(-0.4,-2) 4(-0.001,-2) 5(0.4,-2) 6(0.8,-2) 7(1.2,-2) 15(1.2,2) 16(0.8,2) 17(0.4,2) 18(0,2) 19(-0.4,2) 20(-0.8,2) 21(-1.2,2)
  rect 0.7x0.2 smd: 8(2,-1.2) 9(2,-0.8) 10(2,-0.4) 11(1.999,0) 12(2,0.4) 13(2,0.8) 14(2,1.2) 22(-2,1.2) 23(-2,0.8) 24(-2,0.4) 25(-2,0) 26(-2,-0.4) 27(-2,-0.8) 28(-2,-1.2)
  rect 2.8x2.8 smd: 29(0.001,0.02)
R0402_1005M_S
  rrect 0.47x0.52 smd: 1(-0.43,0) 2(0.43,0)
SOD-523_L1.2-W0.8-LS1.6-RD
  rect 0.6x0.36 smd: 1(-0.65,0) 2(0.65,0)
SOD-523_L1.2-W0.8-LS1.6-RD#2
  rrect 0.7x0.45 smd: 1(-0.6,0) 2(0.6,0)
SOIC-8_L5.3-W5.3-P1.27-LS8.0-BL
  rrect 0.63x1.625 smd: 1(-1.905,-3.53) 2(-0.635,-3.53) 3(0.635,-3.53) 4(1.905,-3.53) 5(1.905,3.53) 6(0.635,3.53) 7(-0.635,3.53) 8(-1.905,3.53)
SW-SMD_DSHP01TSGET
  rrect 0.762x1.27 smd: 1(0,3.81) 2(0,-3.81)
TYPE-C-SMD_TYPE-C-24P_QCHT
  oval 1x1.6 hole 0.6x1.2: 1(4.49,-3.158) 2(-4.49,-3.158) 3(-4.13,1.232) 4(4.13,1.232)
  rrect 0.275x1.25 smd: A1(-2.79,3.158) A2(-2.25,3.158) A3(-1.75,3.158) A4(-1.25,3.158) A5(-0.75,3.158) A6(-0.25,3.158) A7(0.25,3.158) A8(0.75,3.158) A9(1.25,3.158) A10(1.75,3.158) A11(2.25,3.158) A12(2.75,3.158)
  round 0.6 hole 0.4: B1(2.8,1.833) B2(2.4,1.133) B3(1.601,1.133) B4(1.2,1.833) B5(0.8,1.133) B6(0.4,1.833) B7(-0.4,1.833) B8(-0.8,1.133) B9(-1.2,1.833) B10(-1.6,1.133) B11(-2.4,1.133) B12(-2.8,1.833)
UDFN-6_L1.6-W1.0-P0.50-BL
  rect 0.22x0.48 smd: 1(-0.5,-0.378) 2(0,-0.378) 5(0,0.378) 6(-0.5,0.378)
  rect 0.4x0.521 smd: 3(0.5,-0.358)
  rect 0.4x0.51 smd: 4(0.5,0.362)
VQFN-24_L4.0-W4.0-P0.50-TL-EP2.5
  rect 0.6x0.25 smd: 1(-1.9,1.25) 2(-1.9,0.75) 3(-1.9,0.25) 4(-1.9,-0.25) 5(-1.9,-0.75) 6(-1.9,-1.25) 13(1.9,-1.25) 14(1.9,-0.75) 15(1.9,-0.25) 16(1.9,0.25) 17(1.9,0.75) 18(1.9,1.25)
  rect 0.25x0.6 smd: 7(-1.25,-1.9) 8(-0.75,-1.9) 9(-0.25,-1.9) 10(0.249,-1.9) 11(0.75,-1.9) 12(1.25,-1.9) 19(1.25,1.9) 20(0.75,1.9) 21(0.249,1.9) 22(-0.25,1.9) 23(-0.75,1.9) 24(-1.25,1.9)
  rect 2.45x2.45 smd: 25(0,0)
WQFN-30_L4.5-W2.5-P0.4-BL-EP
  custom 0.2x0.5 smd: 1(-1.8,-1.2) 10(1.8,-1.2) 16(1.8,1.2) 25(-1.8,1.2)
  oval 0.2x0.505 smd: 2(-1.4,-1.2) 3(-1,-1.2) 4(-0.6,-1.2) 5(-0.2,-1.2) 6(0.2,-1.2) 7(0.6,-1.2) 8(1,-1.2) 9(1.4,-1.2) 17(1.4,1.2) 18(1,1.2) 19(0.6,1.2) 20(0.2,1.2) 21(-0.2,1.2) 22(-0.6,1.2) 23(-1,1.2) 24(-1.4,1.2)
  custom 0.5x0.2 smd: 11(2.2,-0.8) 15(2.2,0.8) 26(-2.2,0.8) 30(-2.2,-0.8)
  oval 0.505x0.2 smd: 12(2.2,-0.4) 13(2.2,0) 14(2.2,0.4) 27(-2.2,0.4) 28(-2.2,0) 29(-2.2,-0.4)
  rect 3.2x1.2 smd: 31(0,0)
WSON-6_L2.0-W2.0-P0.65-TL-EP
  rrect 0.5x0.35 smd: 1(-0.98,0.65) 2(-0.98,0) 3(-0.98,-0.65) 4(0.98,-0.65) 5(0.98,0) 6(0.98,0.65)
  rrect 1x1.6 smd: 7(0,0)

## Nets
GND: C1.1 C2.1 C3.1 C4.1 C5.1 C6.1 C7.1 C17.1 C18.1 C19.1 C20.1 C21.1 C22.1 C23.1 C24.1 C25.1 C26.1 C28.2 C30.2 C32.2 C158.1 C159.1 C160.1 C161.1 C162.1 C163.1 C164.1 C165.1 C166.1 C170.1 C171.1 C173.1 C174.1 C175.1 C176.1 C177.1 C178.1 C179.1 C180.1 C181.1 C182.1 C185.1 C186.1 C187.1 C188.1 C189.1 C190.1 C191.1 C192.1 C193.1 C194.1 C195.1 C197.1 C198.1 C199.1 C200.1 C201.1 C202.1 C203.1 C204.1 C205.1 C206.1 C207.1 CN7.2 CN7.4 CN7.9 CN7.10 CN7.15 CN7.16 CN7.21 CN7.22 CN7.27 CN7.28 CN7.33 CN7.42 CN7.47 CN7.56 CN7.61 CN7.70 CN7.75 CN7.76 CN8.9 CN8.10 CN8.23 CN8.24 CN8.37 CN8.38 CN8.51 CN8.52 CN8.65 CN8.66 CN8.71 CN8.76 CN8.77 CN8.79 D1.3 D1.8 D2.3 D2.8 D3.3 D3.8 D6.3 D6.8 D7.2 D8.2 D9.2 D10.3 D10.4 D11.2 H1.1 H2.1 H3.1 H4.1 LED4.1 LED5.1 LED6.1 OSC1.3 OSC3.2 R3.1 R4.2 R17.2 R19.2 R23.1 R92.1 R115.2 R123.1 R124.1 R126.1 R127.1 R128.1 SW6.3 SW6.4 SW7.3 SW7.4 U1.A1 U1.A5 U1.A7 U1.A8 U1.A11 U1.A18 U1.B3 U1.B7 U1.B8 U1.B18 U1.C2 U1.C6 U1.C7 U1.C15 U1.D3 U1.D4 U1.D7 U1.D12 U1.E2 U1.E6 U1.E7 U1.E9 U1.E11 U1.F4 U1.F6 U1.F10 U1.F16 U1.G1 U1.G5 U1.G6 U1.G7 U1.G9 U1.G11 U1.G13 U1.H3 U1.H4 U1.H5 U1.H6 U1.H8 U1.H10 U1.H12 U1.J1 U1.J2 U1.J3 U1.J7 U1.J9 U1.J11 U1.J13 U1.J17 U1.K4 U1.K8 U1.K9 U1.K10 U1.K12 U1.K14 U1.L1 U1.L7 U1.L9 U1.L10 U1.L11 U1.L13 U1.M8 U1.M9 U1.M10 U1.M12 U1.M18 U1.N5 U1.N7 U1.N9 U1.N11 U1.N13 U1.N15 U1.P2 U1.P8 U1.P12 U1.R9 U1.T6 U1.T16 U1.U3 U1.U13 U1.V1 U1.V10 U1.V18 U2.1 U2.4 U2.6 U2.13 U2.18 U2.25 U3.13 U3.28 U3.31 U4.3 U4.7 U5.20 U5.29 U15.4 U16.6 U16.9 U16.10 USB1.1 USB1.2 USB1.3 USB1.4 USB1.A1 USB1.A12 USB1.B1 USB1.B12 X2.2 X2.4
VBUS_5V: C1.2 C206.2 F1.1 R2.1 USB1.A4 USB1.A9 USB1.B4 USB1.B9
VCC_1V0: C31.2 C32.1 C173.2 C185.2 C186.2 C187.2 C188.2 C189.2 C193.2 C199.2 C200.2 FB8.1 L6.1 R18.1 U1.F7 U1.F9 U1.F11 U1.G8 U1.G10 U1.H7 U1.H9 U1.H11 U1.J8 U1.J12 U1.K7 U1.K11 U1.L8 U1.L12 U1.M7 U1.M11 U1.N8 U1.N10 U1.N12 U1.P9 U1.P11
VCC_1V8: C16.2 C17.2 C23.2 C24.2 C171.2 C194.2 C195.2 C197.2 C198.2 CN8.78 FB6.1 L4.2 R10.2 U1.G12 U1.H13 U1.J10 U1.K13 U1.M13 U1.P13
VCC_1V8_F: C174.2 FB6.2 U4.4 U4.5 U4.6
VCC_2V5: C27.2 C28.1 C158.2 C177.2 C178.2 C179.2 CN7.3 CN8.73 FB4.1 L3.1 R11.1 U1.A16 U1.B13 U1.C10 U1.D17 U1.E14 U1.G18 U1.H15
VCC_2V5_CLK: C159.2 FB4.2 OSC3.4
VCC_3V3: C25.2 C26.2 C29.2 C30.1 C160.2 C161.2 C162.2 C163.2 C164.2 C165.2 C166.2 C180.2 C181.2 C182.2 C190.2 C191.2 C202.2 C203.2 CN8.75 L5.1 OSC1.6 R16.1 R22.2 R26.2 R29.2 R30.2 R47.2 R113.2 R116.2 R125.2 R129.2 R130.2 R134.1 SW8.2 U1.E10 U1.E12 U1.L6 U1.L16 U1.M3 U1.P7 U1.P17 U1.R4 U1.R10 U1.R14 U1.T1 U1.T11 U1.U8 U1.U18 U1.V5 U1.V15 U3.8 U5.6 U5.21 U15.8
VCC_5V: C18.2 C19.2 C20.2 C21.2 C22.2 C192.2 C207.2 CN7.1 CN8.80 FB7.2 R111.1 R112.1 U2.3 U2.8 U2.11 U2.20 U2.23 U3.30
$5I25826\$1N3017: R2.2 U3.5
$5I25826\$1N3099: R123.2 U3.3
$5I25826\$1N3103: R124.2 U3.4
$5I25826\$1N3105: R125.1 U3.11
$5I25826\$1N3107: R126.2 U3.12
$5I25826\$1N3109: R127.2 U3.22
$5I25826\$1N3115: R128.2 U3.29
$5I25826\SS3220_SCL: R129.1 U3.26
$5I25826\SS3220_SDA: R130.1 U3.25
$5I25826\TYPEC_CC1: D3.5 D3.6 U3.2 USB1.A5
$5I25826\TYPEC_CC2: D3.4 D3.7 U3.1 USB1.B5
$5I25826\USBC_RX1_N: D1.1 D1.10 U3.14 USB1.B10
$5I25826\USBC_RX1_P: D1.2 D1.9 U3.15 USB1.B11
$5I25826\USBC_RX2_N: D2.4 D2.7 U3.18 USB1.A10
$5I25826\USBC_RX2_P: D2.5 D2.6 U3.19 USB1.A11
$5I25826\USBC_TX1_C_N: C11.2 U3.17
$5I25826\USBC_TX1_C_P: C10.2 U3.16
$5I25826\USBC_TX1_N: C11.1 D1.5 D1.6 USB1.A3
$5I25826\USBC_TX1_P: C10.1 D1.4 D1.7 USB1.A2
$5I25826\USBC_TX2_C_N: C8.2 U3.21
$5I25826\USBC_TX2_C_P: C9.2 U3.20
$5I25826\USBC_TX2_N: C8.1 D3.2 D3.9 USB1.B3
$5I25826\USBC_TX2_P: C9.1 D3.1 D3.10 USB1.B2
$9I130\$1N807: L3.2 U2.24
$9I130\$1N809: L4.1 U2.19
$9I130\$1N1163: C16.1 R3.2 R10.1 U2.17
$9I130\$1N9621: C27.1 R4.1 R11.2 U2.2
$9I130\$1N9972: L5.2 U2.7
$9I130\$1N9975: C29.1 R16.2 R17.1 U2.5
$9I130\$1N10203: L6.2 U2.12
$9I130\$1N10206: C31.1 R18.2 R19.1 U2.14
CH32_NRST: C201.2 U5.3
CH32_USB2_D_N: D2.2 D2.9 U5.27 USB1.A7 USB1.B7
CH32_USB2_D_P: D2.1 D2.10 U5.28 USB1.A6 USB1.B6
CLK_50M: R91.2 U1.E15
CLK_125M_N: C13.1 OSC1.4 R132.2
CLK_125M_P: C12.1 OSC1.5 R132.1
FPGA_CCLK: R110.1 U1.E8
FPGA_DONE: CN8.34 LED2.1 R47.1 U1.F12
FPGA_M0: R116.1 U1.R12
FPGA_M1: D11.1 R115.1 SW8.1 U1.F13 U1.R11
FPGA_PUDC_B: R22.1 R23.2 U1.J18
FPGA_QSPI_CLK: CN7.80 R110.2 U15.6
FPGA_QSPI_CS: R113.1 U1.L15 U15.1
FPGA_QSPI_DQ0: U1.K16 U15.5
FPGA_QSPI_DQ1: CN7.78 U1.L17 U15.2
FPGA_QSPI_DQ2: U1.J15 U15.3
FPGA_QSPI_DQ3: U1.J16 U15.7
FPGA_TCK: R15.1 R137.2 U1.F8
FPGA_TCK_R: D6.4 D6.7 R15.2 U16.7
FPGA_TDI: R25.1 U1.T9
FPGA_TDI_R: D6.2 D6.9 R25.2 R136.2 U16.5
FPGA_TDO: R12.1 R138.2 U1.T8
FPGA_TDO_R: D6.1 D6.10 R12.2 U16.4
FPGA_TMS: R21.1 R135.2 U1.R8
FPGA_TMS_R: D6.5 D6.6 R21.2 U16.8
INIT_B: R30.1 U1.T10
IO_0_14: U1.L14
IO_0_15: U1.D10
IO_0_34: U1.J6
IO_25_14: R97.1 U1.U10
IO_25_15: U1.H14
IO_25_34: U1.R6
IO_L1N_T0_34: U1.K5
IO_L1N_T0_AD0N_15: CN7.30 U1.C8
IO_L1P_T0_34: U1.K6
IO_L1P_T0_AD0P_15: CN7.32 U1.D8
IO_L2N_T0_34: U1.J4
IO_L2N_T0_AD8N_15: CN7.44 U1.C9
IO_L2P_T0_34: U1.J5 U5.16
IO_L2P_T0_AD8P_15: CN7.46 U1.D9
IO_L3N_T0_DQS_34: U1.K1 U5.11
IO_L3N_T0_DQS_AD1N_15: CN7.36 U1.A9
IO_L3N_T0_DQS_EMCCLK_14: R131.1 U1.K18
IO_L3P_T0_DQS_34: U1.K2 U5.12
IO_L3P_T0_DQS_AD1P_15: CN7.34 U1.B9
IO_L4N_T0_15: CN7.37 U1.B11
IO_L4N_T0_34: U1.L2 U5.10
IO_L4N_T0_D05_14: CN8.3 U1.L18
IO_L4P_T0_15: CN7.35 U1.C11
IO_L4P_T0_34: U1.K3 U5.15
IO_L4P_T0_D04_14: CN8.1 U1.K17
IO_L5N_T0_34: U1.L3 U5.14
IO_L5N_T0_AD9N_15: CN7.40 U1.A10
IO_L5N_T0_D07_14: U1.K15
IO_L5P_T0_34: U1.L4 U5.13
IO_L5P_T0_AD9P_15: CN7.38 U1.B10
IO_L5P_T0_D06_14: U1.J14
IO_L6N_T0_D08_VREF_14: U1.M15
IO_L6N_T0_VREF_15: CN7.50 U1.C12
IO_L6N_T0_VREF_34: U1.M5 U5.7
IO_L6P_T0_15: CN7.48 U1.D11
IO_L6P_T0_34: U1.L5 U5.9
IO_L7N_T1_34: CN8.72 U1.M1
IO_L7N_T1_AD2N_15: CN7.39 U1.A12
IO_L7N_T1_D10_14: CN8.7 U1.M17
IO_L7P_T1_34: CN8.74 U1.M2
IO_L7P_T1_AD2P_15: CN7.41 U1.B12
IO_L7P_T1_D09_14: CN8.5 U1.M16
IO_L8N_T1_34: U1.N6
IO_L8N_T1_AD10N_15: CN7.45 U1.A14
IO_L8N_T1_D12_14: U1.N14
IO_L8P_T1_34: U1.M6
IO_L8P_T1_AD10P_15: CN7.43 U1.A13
IO_L8P_T1_D11_14: U1.M14
IO_L9N_T1_DQS_34: CN8.68 U1.P1
IO_L9N_T1_DQS_AD3N_15: U1.B15
IO_L9N_T1_DQS_D13_14: CN8.2 U1.N17
IO_L9P_T1_DQS_14: CN8.4 U1.N16
IO_L9P_T1_DQS_34: CN8.70 U1.N1
IO_L9P_T1_DQS_AD3P_15: U1.C14
IO_L10N_T1_34: U1.N4 U5.4
IO_L10N_T1_AD11N_15: CN7.51 U1.A15
IO_L10N_T1_D15_14: CN8.13 U1.P18
IO_L10P_T1_34: U1.M4 U5.8
IO_L10P_T1_AD11P_15: CN7.49 U1.B14
IO_L10P_T1_D14_14: CN8.11 U1.N18
IO_L11N_T1_SRCC_14: CN8.6 U1.P16
IO_L11N_T1_SRCC_15: CN7.54 U1.C13
IO_L11N_T1_SRCC_34: U1.N2
IO_L11P_T1_SRCC_14: CN8.8 U1.P15
IO_L11P_T1_SRCC_15: CN7.52 U1.D13
IO_L11P_T1_SRCC_34: U1.N3 U5.5
IO_L12N_T1_MRCC_14: U1.R15
IO_L12N_T1_MRCC_15: CN7.60 U1.D14
IO_L12N_T1_MRCC_34: CN8.60 U1.P3
IO_L12P_T1_MRCC_14: U1.P14
IO_L12P_T1_MRCC_15: CN7.58 U1.E13
IO_L12P_T1_MRCC_34: CN8.58 U1.P4
IO_L13N_T2_MRCC_14: CN8.20 U1.T15
IO_L13N_T2_MRCC_34: CN8.67 U1.R1
IO_L13P_T2_MRCC_14: CN8.22 U1.T14
IO_L13P_T2_MRCC_34: CN8.69 U1.R2
IO_L14N_T2_SRCC_14: CN8.12 U1.R17
IO_L14N_T2_SRCC_15: CN7.64 U1.D16
IO_L14N_T2_SRCC_34: CN8.56 U1.T2
IO_L14P_T2_SRCC_14: CN8.14 U1.R16
IO_L14P_T2_SRCC_15: CN7.62 U1.E16
IO_L14P_T2_SRCC_34: CN8.54 U1.R3
IO_L15N_T2_DQS_34: CN8.62 U1.U1
IO_L15N_T2_DQS_ADV_B_15: CN7.55 U1.A17
IO_L15N_T2_DQS_DOUT_CSO_B_14: CN8.17 U1.T18
IO_L15P_T2_DQS_15: CN7.53 U1.B16
IO_L15P_T2_DQS_34: CN8.64 U1.U2
IO_L15P_T2_DQS_RDWR_B_14: CN8.15 U1.R18
IO_L16N_T2_34: CN8.63 U1.V2
IO_L16N_T2_A15_D31_14: CN8.21 U1.U17
IO_L16N_T2_A27_15: CN7.66 U1.B17
IO_L16P_T2_34: CN8.61 U1.V3
IO_L16P_T2_A28_15: CN7.68 U1.C16
IO_L16P_T2_CSI_B_14: CN8.19 U1.T17
IO_L17N_T2_34: CN8.50 U1.T3
IO_L17N_T2_A13_D29_14: CN8.16 U1.U16
IO_L17N_T2_A25_15: CN7.63 U1.D18
IO_L17P_T2_34: CN8.48 U1.T4
IO_L17P_T2_A14_D30_14: CN8.18 U1.U15
IO_L17P_T2_A26_15: CN7.65 U1.E17
IO_L18N_T2_34: CN8.57 U1.V4
IO_L18N_T2_A11_D27_14: CN8.25 U1.V17
IO_L18N_T2_A23_15: CN7.57 U1.C18
IO_L18P_T2_34: CN8.59 U1.U4
IO_L18P_T2_A12_D28_14: CN8.27 U1.V16
IO_L18P_T2_A24_15: CN7.59 U1.C17
IO_L19N_T3_A09_D25_VREF_14: CN8.28 U1.T13
IO_L19N_T3_A21_VREF_15: CN7.71 U1.F18
IO_L19N_T3_VREF_34: R140.2 U1.P5
IO_L19P_T3_34: U1.P6
IO_L19P_T3_A10_D26_14: CN8.26 U1.R13
IO_L19P_T3_A22_15: CN7.73 U1.G17
IO_L20N_T3_34: CN8.55 U1.U5
IO_L20N_T3_A07_D23_14: CN8.31 U1.V14
IO_L20N_T3_A19_15: CN7.72 U1.G16
IO_L20P_T3_34: CN8.53 U1.U6
IO_L20P_T3_A08_D24_14: CN8.29 U1.U14
IO_L20P_T3_A20_15: CN7.74 U1.H16
IO_L21N_T3_DQS_34: CN8.44 U1.T5
IO_L21N_T3_DQS_A06_D22_14: CN8.33 U1.V13
IO_L21N_T3_DQS_A18_15: U1.F15
IO_L21P_T3_DQS_14: CN8.35 U1.V12
IO_L21P_T3_DQS_15: R96.2 U1.G15
IO_L21P_T3_DQS_34: CN8.46 U1.R5
IO_L22N_T3_34: CN8.40 U1.T7
IO_L22N_T3_A04_D20_14: U1.U12
IO_L22N_T3_A16_15: U1.F14
IO_L22P_T3_34: CN8.42 U1.R7
IO_L22P_T3_A05_D21_14: U1.T12
IO_L22P_T3_A17_15: U1.G14
IO_L23N_T3_34: CN8.49 U1.V6
IO_L23N_T3_A02_D18_14: CN8.32 U1.V11
IO_L23N_T3_FWE_B_15: CN7.79 U1.H18
IO_L23P_T3_34: CN8.47 U1.U7
IO_L23P_T3_A03_D19_14: CN8.30 U1.U11
IO_L23P_T3_FOE_B_15: CN7.77 U1.H17
IO_L24N_T3_34: CN8.45 U1.V7
IO_L24N_T3_A00_D16_14: CN8.39 U1.V9
IO_L24N_T3_RS0_15: CN7.67 U1.E18
IO_L24P_T3_34: CN8.43 U1.V8
IO_L24P_T3_A01_D17_14: CN8.41 U1.U9
IO_L24P_T3_RS1_15: CN7.69 U1.F17
JTAG_TCK: R137.1 U5.23
JTAG_TDI: R136.1 U5.25
JTAG_TDO: R138.1 U5.24
JTAG_TMS: R135.1 U5.26
JTAG_VREF: D9.1 R134.2 U16.3
MCU_IO0: R139.1 U5.17
MCU_IO1: R89.2 R140.1 U5.18
MCU_SWCLK: D10.2 D10.5 U5.22 U16.2
MCU_SWDIO: D10.1 D10.6 U5.19 U16.1
MCU_XI: C204.2 U5.1 X2.3
MCU_XO: C205.2 U5.2 X2.1
MGT_CLK0_N: C15.2 U1.D5
MGT_CLK0_P: C14.2 U1.D6
MGT_CLK1_N: C13.2 U1.B5
MGT_CLK1_P: C12.2 U1.B6
MGT_EXTCLK0_N: C15.1 CN7.29 R133.2
MGT_EXTCLK0_P: C14.1 CN7.31 R133.1
MGT_RX0_N: U1.E3 U3.10
MGT_RX0_P: U1.E4 U3.9
MGT_RX1_N: CN7.23 U1.A3
MGT_RX1_P: CN7.25 U1.A4
MGT_RX2_N: CN7.18 U1.C3
MGT_RX2_P: CN7.20 U1.C4
MGT_RX3_N: CN7.24 U1.G3
MGT_RX3_P: CN7.26 U1.G4
MGT_TX0_N: U1.H1 U3.6
MGT_TX0_P: U1.H2 U3.7
MGT_TX1_N: CN7.12 U1.F1
MGT_TX1_P: CN7.14 U1.F2
MGT_TX2_N: CN7.11 U1.D1
MGT_TX2_P: CN7.13 U1.D2
MGT_TX3_N: CN7.19 U1.B1
MGT_TX3_P: CN7.17 U1.B2
MGTAVCC_1V0: C2.2 C4.2 C5.2 C175.2 FB8.2 U1.B4 U1.C5 U1.E5 U1.F5
MGTAVTT_1V2: C3.2 C6.2 C7.2 C176.2 R1.2 U1.A2 U1.C1 U1.E1 U1.F3 U1.G2 U4.1 U4.2
OSC_50M: OSC3.3 R91.1
PROGRAM_B: CN8.36 R29.1 U1.P10
$1N9867: LED2.2 R26.1
$4N1169: R1.1 U1.A6
$6N1068: OSC3.1 R92.2
$9N354: R111.2 U2.10
$9N358: C170.2 R112.2 U2.9 U2.21 U2.22
$9N704: F1.2 FB7.1
$10N273: LED4.2 R97.2
$10N513: D7.1 R96.1 SW6.1
$10N1466: LED5.2 R131.2
$12N5394: D8.1 R89.1 SW7.1
$12N5519: LED6.2 R139.2

Pads without a net: CN7 5 6 7 8; OSC1 1 2; SW6 2; SW7 2; U1 D15; U2 15 16; U3 23 24 27; USB1 A8 B8

## Via types
v1: diameter 0.5, hole 0.3, Top Layer to Bottom Layer, 37 vias
v2: diameter 0.45, hole 0.3, Top Layer to Bottom Layer, 536 vias
v3: diameter 0.5, hole 0.305, Top Layer to Bottom Layer, 20 vias
v4: diameter 0.61, hole 0.305, Top Layer to Bottom Layer, 9 vias
v5: diameter 0.55, hole 0.35, Top Layer to Bottom Layer, 15 vias
v6: diameter 0.6, hole 0.4, Top Layer to Bottom Layer, 3 vias
v7: diameter 0.65, hole 0.4, Top Layer to Bottom Layer, 2 vias
v8: diameter 0.61, hole 0.4, Top Layer to Bottom Layer, 1 via

## Routing (per net, layer and track width the routed paths; a pad name or vN(x,y) marks a point on that pad's centre or on a via; arc(x,y) is an arc through that point)
GND: length 303
  Top Layer w0.14: v2(8.21,12.16) D6.3 v2(6.26,12.16)
  Top Layer w0.145: R23.1 v2(53.88,28.9)
  Top Layer w0.15: U1.B3 29.37,31 ; 29.37,31 29.37,31.78 v2(28.75,32.4) ; 29.37,31 28.57,31 U1.A1 ; v2(31.75,21.4) 32.55,21.4 32.95,21.8 U1.N7 ; v1(14,31.61) 14.48,31.61 14.5,31.63
  Top Layer w0.2: D3.3 D3.8 ; C160.1 48.81,32.86 v2(49.56,32.86) ; D10.4 D10.3 ; D2.3 D2.8 ; 33.55,34.9 33.5,34.9 33.4,34.8 33.4,34.36 32.78,33.75 32.78,32.57 arc(32.83,32.3) 32.98,32.07 arc(32.99,32.06) v2(33,32.05) ; C203.1 18.2,28.09 18.63,27.66 U5.20 ; v1(20.95,37.61) 20.38,37.61 C191.1 ; R126.1 v1(18.7,39.81) ; U3.13 v1(16.8,37.66) v1(16.8,36.91) v1(16.8,36.11) v1(16.8,35.31) U3.28 ; R124.1 20.65,34.99 v1(20.65,34.76) 20.35,34.46 R123.1
  Top Layer w0.25: v2(36.16,32) 36.16,31.41 U1.A11 ; v2(48.1,36.8) 48.62,36.8 R92.1 ; v2(27.29,23.16) 27.65,23.16 27.91,23.42 28.15,23.42 U1.L1 ; v2(34.15,38.15) 34.15,37.43 34.2,37.38 ; v2(35.75,24.6) 35.75,24.58 35.39,24.21 ; 34.59,23.4 34.19,23.8 34.18,23.8 ; U1.H4 30.55,25.8 v2(30.15,25.4) 30.15,25.42 U1.H3 ; C165.1 39.73,13.32 v6(39.73,12.67) ; U1.A8 U1.A7 33,31.43 v2(33,32.05) ; U1.M8 U1.M9 U1.L10 U1.L11 ; U1.J17 41.35,25.38 v2(41.35,25.4) ; U1.U13 37.4,18.23 v2(37.4,18.2) ; U1.D12 36.95,29 v2(36.55,28.6) ; U1.M18 42.28,22.6 42.68,23 v2(42.88,23) ; v2(32.55,26.95) 32.17,27.33 ; U1.V10 35.37,17.25 v2(35.39,17.23) ; C158.1 51.22,35.24 v2(51.22,35.84) ; U1.B18 U1.A18 41.77,31.62 arc(41.82,31.85) v2(41.95,32.05) ; 34.18,23.8 U1.K9 ; 34.18,23.8 v2(34.17,23.8) ; U1.P2 v2(28.57,21.4) ; v2(44.37,27.01) 44.37,26.97 C178.1 ; 30.93,38.7 30.31,38.7 v2(29.81,39.2) ; v2(32.6,35) 33.45,35 33.55,34.9 ; OSC3.2 47.67,36.12 v2(47.67,36.23) ; C162.1 43.83,20.58 v2(43.83,20.06) ; 35.39,24.21 U1.K10 ; 35.39,24.21 35.39,24.2 ; v2(32.55,23.8) 32.57,23.8 U1.L7 ; U1.G11 36.18,26.6 v2(36.54,26.96) ; LED5.1 51.85,23.8 U15.4 ; C179.1 41.6,33.1 v2(41.57,33.07) ; v2(34.97,22.2) U1.N9
  Top Layer w0.254: v4(8.27,22.23) 8.72,21.78 U2.6 8.72,20.76 9.28,20.2 R17.2 ; U1.M8 U1.N7 ; v2(35.77,23) U1.L10 U1.K9 34.57,24.23 34.2,24.6 ; R4.2 5.76,20.26 6.22,20.72 U2.1 6.22,21.71 v4(6.75,22.23) ; U1.G11 U1.H12 ; U1.H12 U1.G13 ; U1.H12 U1.J13 ; U1.U3 v2(29.37,18.2) ; U1.L13 U1.M12 ; U1.M12 U1.N13 U1.P12 ; U1.M12 U1.N11 ; U1.G5 U1.H5 ; U1.G5 U1.F4 30.95,27.78 v2(30.95,27.8) ; U1.G5 U1.G6 32.42,26.85 32.72,26.85 U1.G7 ; U1.H5 31.57,26 31.97,26 U1.H6 U1.J7 U1.H8 U1.G9 U1.F10 U1.E9 34.57,28.23 34.25,28.55 ; U1.H5 31.12,26.05 30.83,26.05 U1.H4 ; U1.A7 U1.B7 U1.C6 ; U1.C6 U1.D7 32.7,28.73 32.7,28.47 U1.E7 U1.E6 U1.F6 32.17,27.33 ; U1.C6 U1.C7 ; U1.J13 U1.K14 ; U1.J13 U1.K12 ; U1.C2 U1.D3 30.15,29.38 v2(30.15,29.4) 30.55,29 U1.D4 ; U1.E11 36.17,28.22 v2(36.55,28.6) ; U1.P8 U1.R9 34.95,19.82 v2(34.95,19.8) ; v3(7.53,17.63) 7.53,18.36 C22.1 ; U2.4 7.72,22.73 U2.25 ; U1.J3 U1.K4 ; v3(9.53,26.41) 8.78,25.66 8.72,25.66 U2.13 8.72,24.23 U2.25 ; U1.N5 v2(30.97,21.4) ; v2(31.72,19) 32.12,19.4 U1.T6 ; v2(26.62,26.95) 27.14,26.95 27.49,26.6 U1.G1 ; U1.A8 U1.B8 ; U1.M10 34.97,23 ; U1.N15 v2(39.77,21.4) ; v2(31.37,32) U1.A5 ; 28.97,25 v2(28.56,25.41) 28.17,25.02 U1.J1 ; U1.V1 v2(27.77,17.4) ; U2.25 6.22,24.23 U2.18 6.22,25.72 6.05,25.72 v3(5.48,26.28) ; U1.K8 U1.J9 U1.H10 ; v2(35.75,24.6) 35.77,24.6 U1.J11 ; U1.M9 v2(34.97,22.2) ; v2(28.57,28.6) U1.E2 ; U1.C15 v2(39.77,30.2) ; U1.A1 27.76,31.4 27.31,31.85 v2(27.31,32.12) ; U1.F16 v2(40.57,27.8) ; U1.T16 v2(40.57,19)
  Top Layer w0.27: v1(10.1,39.11) 9.94,38.95 USB1.A1
  Top Layer w0.28: USB1.B1 7.78,33.4 8.89,33.4 8.94,33.36 arc(9,33.37) USB1.A12
  Top Layer w0.3: USB1.A12 9.06,33.2 arc(9.09,33.02) v1(9.2,32.86) ; v1(12.95,32.71) D3.8 ; v2(42.45,17.1) 42.45,17.12 U1.V18 ; v1(12.95,35.71) D2.8 ; U15.4 51.5,25.36 v2(51.5,25.37) ; C192.1 18.82,31.78 v1(18.85,31.81) ; v1(10.86,35.69) 11.45,35.69 D2.3 ; v1(10.85,39.26) D1.3 v1(12.95,39.26) ; 11.42,32.71 v1(10.85,32.71)
  Top Layer w0.32: v2(20.55,18.09) 16.96,18.09 v2(16.35,18.7) 16.2,18.85 v2(16.2,20.71) 16.48,20.99 C204.1 17.55,20.99 ; v2(20.55,18.09) 21.78,19.32 v2(21.78,19.49) 21.79,19.5 C205.1 22.31,20.13 22.8,20.62 v2(22.8,21.05) ; v2(20.55,18.09) 20.51,18.13 X2.4 ; v2(6.65,8.19) 6.67,8.17 D10.4 ; C174.1 21.6,29.43 v2(22.15,28.88) ; C201.1 16.81,23.04 v2(17.52,23.04) ; U4.3 20.37,33.14 C176.1 20.57,33.84 v2(20.7,33.97) ; v2(16.98,28.82) 16.97,28.83 C171.1 16.97,30.15 v2(16.98,30.16) ; C206.1 12.91,41.76 v2(12.75,41.6) ; C206.1 13.57,43.17 v2(13.57,43.41) ; C206.1 13.52,41.9 v2(13.52,41.58) ; C206.1 12.91,43.25 v2(12.75,43.41) ; v2(22.15,21.66) 22.14,21.67 C202.1 ; 52.28,37.98 v2(53.07,37.98) 53.1,38.01 ; D8.2 16.79,5.38 v2(16.65,5.38) ; X2.2 18.04,20.99 17.55,20.99 ; v2(8.53,8.23) 8.47,8.17 7.96,8.17 ; D11.2 v2(50.75,9.4) ; SW7.4 13.78,2.22 v2(13.25,1.7) ; LED4.1 53.5,15.69 v2(53.48,15.71) ; v2(27.31,32.12) 27.31,33.1 C3.1 ; C198.1 1.68,26.82 v2(1.93,26.57) ; D7.2 48.93,39.82 v2(48.92,39.83) ; 52.13,33.41 52.66,33.41 v2(52.67,33.42) ; v2(52.06,14.26) 52.13,14.19 R115.2 ; SW7.3 13.78,6.11 v2(13.76,6.09) ; 52.28,42.18 v2(53.25,42.18) ; C175.1 15.89,27.9 v2(15.83,27.84) ; v2(11.71,2.56) 11.68,2.59 LED6.1 ; C182.1 30.84,14.27 v2(30.04,14.27) ; v2(17.99,28.66) 17.99,28.1 C203.1 ; R128.1 17.05,31.8 v2(17,31.75) ; 17.55,20.99 17.55,21.4 v2(17.85,21.7) ; C173.1 14.7,27.8 v2(14.83,27.8) ; v2(13.19,16.89) 13.56,17.26 C170.1 ; v2(24.1,21.19) 23.55,20.64 23.55,19.69 21.05,17.19 v2(21.05,16.07) ; D9.2 8.71,10.06 v2(8.72,10.07) ; v2(31.05,39.4) 30.29,39.4 arc(30.03,39.35) v2(29.81,39.2)
  内GND w0.127: 31.4,29.15 31.4,29.22 31.38,29.24 31.38,29.57 31.35,29.6 ; 34.45,29.8 34.4,29.85 34.34,29.85 arc(34.17,29.81) 34,29.85 33.54,29.85 arc(33.37,29.81) 33.2,29.85 ; 29.8,18.65 29.8,18.82 29.78,18.84 29.78,21.57 29.75,21.6 ; 30.75,29 31.2,29 ; 29.75,28.7 29.75,28.45
  内GND w0.13: 38.65,29.85 38.6,29.8 37.8,29.8
  Bottom Layer w0.145: C180.1 27.2,22.3 v2(26.92,22.02)
  Bottom Layer w0.25: v2(35.75,24.6) 36.43,24.6 C187.1 ; v2(36.55,28.6) 36.18,28.23 35.95,28.23 ; v2(37.55,32.9) 37.15,32.5 C177.1 ; C181.1 31,21.4 v2(30.97,21.4) ; v2(38.95,23) 37.72,23 C194.1 ; v2(34.97,22.2) 34.95,22.2 34.18,21.43 ; v2(36.7,16.72) 36.7,17.22 36.27,17.65 ; 37.5,25.22 37.58,25.22 v2(38.2,24.6) 38.75,25.15 38.75,25.22 ; C193.1 37.5,21.5 v2(37.4,21.4) 38.15,21.4 38.35,21.2 ; C189.1 30.92,26.07 30.25,25.4 v2(30.15,25.4) ; C195.1 39.77,21.86 v2(39.77,21.4) ; v2(33.35,25.4) 33.92,25.97 33.92,26.2 ; v2(42.88,23) 42.1,23 C161.1 ; v2(30.15,24.6) 30.2,24.55 C186.1
  Bottom Layer w0.254: C7.1 27.97,29.2 v2(28.57,28.6) ; C26.1 34.95,20.37 v2(34.95,19.8) ; C6.1 26.67,26.9 v2(26.62,26.95) ; v2(30.95,27.8) C4.1 ; 34.12,28.05 34.2,28.13 v2(34.2,28.6) ; v2(28.75,32.4) 29.27,31.88
  Bottom Layer w0.3: 43.45,16.5 43.05,16.5 v2(42.45,17.1)
  Bottom Layer w0.32: v2(20.46,41.43) 20.25,41.64 CN7.16 20.25,44.31 v2(20.51,44.57) ; v2(20.65,5.68) 20.25,6.08 CN8.66 ; v2(15.42,1.47) 15.45,1.5 CN8.77 15.45,4.2 v2(15.44,4.21) ; C185.1 35.1,22.33 v2(34.97,22.2) ; C185.1 35.1,24.52 C200.1 ; C185.1 v2(35.77,23) ; CN7.21 22.65,46.19 ; 22.65,46.19 v2(22.31,45.85) ; 22.65,46.19 22.67,46.19 v2(23,45.86) ; v2(17.5,44.26) 17.5,44.19 17.85,43.84 ; v2(30.64,41.51) 30.65,41.52 CN7.42 ; 25.05,48.24 CN7.27 25.05,46.19 ; 25.05,48.24 25.44,48.63 v2(25.44,48.68) ; 25.05,48.24 24.7,48.59 v2(24.7,48.66) ; v2(25.51,44.31) 25.05,43.85 CN7.28 ; v2(16.34,8.71) 16.25,8.62 CN8.76 16.26,7.19 v2(16.26,5.88) ; C200.1 35.07,25.23 v2(34.95,25.35) ; C200.1 35.7,24.55 v2(35.75,24.6) ; v2(19.92,48.47) 19.92,48.4 20.27,48.05 ; CN8.52 25.85,6.1 v2(26.24,5.71) ; 17.85,48.24 17.5,48.59 v2(17.5,48.66) ; 17.85,48.24 18.24,48.63 v2(18.24,48.68) ; 17.85,48.24 CN7.9 17.85,46.19 ; v2(27.8,45.86) 27.47,46.19 27.45,46.19 ; v2(26.15,4.4) 25.85,4.1 25.85,4.07 ; 44.25,46.19 CN7.75 44.25,48.21 ; 44.25,46.19 v2(43.91,45.85) ; 44.25,46.19 44.25,46.16 v2(44.6,45.81) ; 15.45,43.84 15.1,44.19 v2(15.1,44.26) ; 15.45,43.84 15.84,44.23 v2(15.84,44.28) ; 15.45,43.84 CN7.4 15.45,41.4 v2(15.41,41.36) ; CN8.24 37.05,8.21 v2(37.62,8.78) ; v2(20.47,4.27) 20.25,4.05 CN8.65 ; CN7.70 41.85,44.41 v2(42.38,44.94) ; v2(43.9,48.59) 44.25,48.24 44.25,48.21 ; CN8.71 17.85,4.25 v2(17.77,4.33) ; 27.45,48.24 CN7.33 27.45,46.19 ; 27.45,48.24 27.1,48.59 v2(27.1,48.66) ; 27.45,48.24 27.84,48.63 v2(27.84,48.68) ; 20.27,46.17 20.29,46.17 v2(20.62,45.84) ; 20.27,46.17 20.27,47.18 ; 20.27,46.17 v2(19.93,45.83) ; v2(33.44,48.68) 33.44,48.63 33.05,48.24 ; 27.45,46.19 v2(27.11,45.85) ; 17.85,41.66 v2(17.54,41.35) ; 17.85,41.66 CN7.10 17.85,43.84 ; 17.85,41.66 17.85,41.61 v2(18.14,41.32) ; v2(23.07,48.55) 23.07,48.49 22.68,48.1 22.33,48.45 v2(22.33,48.53) ; 25.05,46.19 25.07,46.19 v2(25.4,45.86) ; 25.05,46.19 v2(24.71,45.85) ; U16.6 6.25,12.15 v2(6.26,12.16) ; v2(36.04,44.31) 36.25,44.1 CN7.56 ; 22.66,42.61 22.66,42.8 ; 38.65,46.19 38.67,46.19 v2(39,45.86) ; 38.65,46.19 CN7.61 38.65,48.24 ; 38.65,46.19 v2(38.31,45.85) ; 17.85,46.19 17.87,46.19 v2(18.2,45.86) ; 17.85,46.19 v2(17.51,45.85) ; v2(14.64,1.51) 14.65,1.52 CN8.79 14.65,4.26 v2(14.64,4.27) ; CN7.15 20.27,47.18 ; 20.27,47.18 20.27,48.05 ; v2(42.91,8.67) 42.65,8.41 CN8.10 ; 44.25,48.21 v2(44.59,48.55) ; 17.85,43.84 18.24,44.23 v2(18.24,44.28) ; 38.65,48.24 38.3,48.59 v2(38.3,48.66) ; 38.65,48.24 39.04,48.63 v2(39.04,48.68) ; CN7.76 44.25,44.16 v2(44.44,44.35) ; CN8.23 37.05,3.83 v2(37.54,4.32) ; 20.27,48.05 20.66,48.44 v2(20.66,48.49) ; v2(14.18,44.23) 14.65,43.76 CN7.2 14.65,41.49 v2(14.56,41.4) ; v2(22.33,44.22) 22.65,43.9 CN7.22 ; 33.05,48.24 32.7,48.59 v2(32.7,48.66) ; 33.05,48.24 CN7.47 33.05,46.08 v2(33.43,45.7) ; CN8.51 25.85,4.07 ; 25.85,4.07 v2(25.5,4.42) ; v2(42.67,4.11) 42.65,4.09 CN8.9 ; CN8.37 31.46,2.79 v2(31.46,1.46) ; v2(31.23,5.6) 31.45,5.82 CN8.38
  Bottom Layer w0.5: USB1.B12 C1.1 v1(10.1,39.11)
  vias: v2(0.72,6.05) v2(0.76,15.25) v2(1.61,15.24) v2(1.62,6.05) v2(2.55,15.23) v2(2.61,6.01) v2(6.82,48.06) v2(6.83,47.11) v2(14.56,25.81) v2(15.79,27.05) v2(18.39,24.07) v2(18.5,26.09) v2(18.49,25.12) v2(18.55,17.9) v2(19.4,26.1) v2(19.43,25.14) v2(19.41,24.09) v2(20.35,31.42) v2(20.28,25.15) v2(20.41,26.15) v2(20.37,24.13) v2(21.02,31.42) v2(21.55,39.1) v2(21.77,31.42) v2(21.85,18.2) v2(23.05,28.6) v2(23.05,19.4) v2(27.85,4.4) v2(29.15,40.8) v2(29.45,45.8) v2(29.45,4.4) v2(31.05,45.8) v2(32.55,25.4) v2(34.95,27) v2(35.05,45.7) v2(36.65,45.8) v2(39.25,4.4) v2(40.65,45.8) v2(40.75,4.4) v2(43.62,15.1) v2(43.62,12.73) v2(44.63,4.26) v2(44.65,8.7) v2(46.31,35.07) v2(46.32,33.59) v2(46.35,31.1) v2(46.35,29.6) v2(46.33,4.26) v3(7.05,17.21) v3(7.05,16.55) v3(7.17,29.39) v3(7.17,28.67) v3(7.95,29.39) v3(7.95,28.67) v3(7.99,17.21) v3(7.99,16.55) v4(6.75,23.76) v4(6.75,23) v4(7.51,23.76) v4(7.51,23) v4(7.51,22.23) v4(8.27,23.76) v4(8.27,23) v5(1.93,24.51) v5(1.93,23.75) v5(1.93,22.99) v5(1.93,22.21) v5(1.93,21.51) v5(13.07,24.51) v5(13.08,23.6) v5(13.09,22.62) v5(13.07,21.51)
VBUS_5V: length 21.2
  Top Layer w0.2: R2.1 v1(20.45,36.16)
  Top Layer w0.25: USB1.A9 9.8,34.91 10.21,35.32 v1(10.21,35.44)
  Top Layer w0.27: USB1.A4 9.93,37.41 arc(10.34,37.54) v1(10.68,37.8)
  Top Layer w0.28: USB1.A4 7.78,37.41 USB1.B9
  内GND&PWR w0.2: v1(20.45,36.16) 19.89,36.72 18.62,36.72 17.91,37.43 17.91,38.35 17.48,38.78 13.83,38.78 13.33,38.28 11.16,38.28 v1(10.68,37.8)
  Bottom Layer w0.5: v1(10.21,35.44) 9.73,34.96 USB1.B4 ; C1.2 v1(10.68,37.8)
  vias: v2(10.4,43.06) v2(10.79,42.38) v2(11.04,43.34)
VCC_1V0: length 50.5
  Top Layer w0.25: U1.N10 U1.M11 ; U1.H11 U1.J12 ; 32.6,26.2 32.6,26.17 U1.H7 ; v2(36.57,27.8) U1.F11 U1.G10 ; v2(32.55,24.6) 32.95,24.2 ; U1.K7 U1.J8 ; U1.M7 U1.L8 ; U1.N8 U1.P9 ; U1.L12 U1.K11
  Top Layer w0.254: U1.N12 36.59,21.42 v2(36.59,21.41) 36.58,21.41 U1.P11 ; U1.G8 U1.F7 ; U1.G8 U1.H7 ; U1.G8 U1.F9 ; U1.N8 v2(33.37,21.4) ; U1.M7 v2(32.57,22.2) ; v2(12.16,30.41) 10.03,30.41 9.61,29.99 9.61,28.09 9.12,27.6 R18.1 C31.2 ; 32.99,24.19 U1.L8 ; U1.K11 U1.J12 ; U1.M11 U1.L12 ; U1.J8 U1.H9 U1.G10 U1.H11 ; U1.P9 U1.N10
  Top Layer w0.3: FB8.1 14.86,28.6 C173.2
  内GND&PWR w0.25: v2(36.59,21.41) 36.54,21.41 v2(35.75,22.2)
  内GND&PWR w0.3: 29.76,23.48 29.46,23.18 28.3,23.18 28.05,23.43 ; 31.38,25.88 30.5,26.75 29.1,26.75 28.25,25.9
  Bottom Layer w0.25: C193.2 36.7,21.52 v2(36.59,21.41) ; v2(33.4,23.8) 33.6,23.6 33.6,21.63 v2(33.37,21.4) 33.62,21.15 33.62,20.87 ; C186.2 31.98,24.6 v2(32.55,24.6) ; v2(36.57,27.8) 36.29,27.52 C188.2 ; v2(36.55,22.95) C187.2 ; v2(32.56,26.2) 31.93,26.2 C189.2
  Bottom Layer w0.32: v2(13.03,26.55) 12.57,27.01 12.57,30 v2(12.16,30.41) ; v2(33.4,23.8) 33.67,24.07 C200.2 34.15,25.03 v2(34.15,25.35)
  vias: v2(34.15,27) v2(36.55,25.4) v3(11.25,29.25) v3(11.27,28.51) v3(11.93,28.53)
